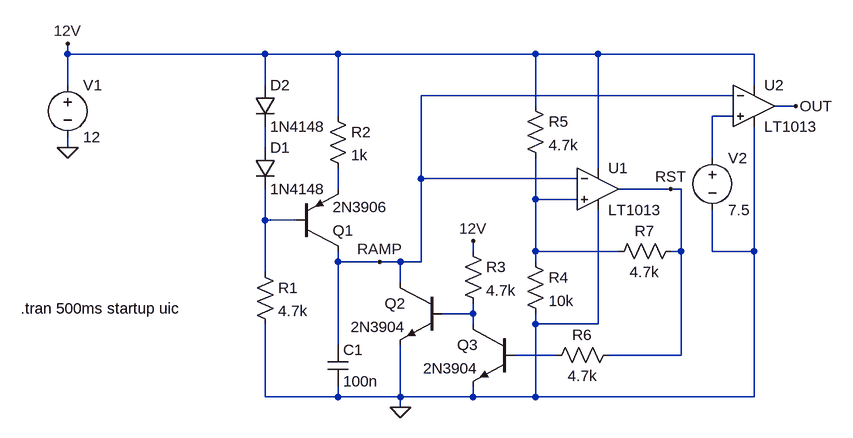
[diagram p0: schematic LAB02 Analogico-1.asc]
LAB02 Analogico-1.asc, the LTspice schematic file:
Version 4
SHEET 1 916 680
WIRE -272 -192 -272 -208
WIRE 32 -192 -272 -192
WIRE 144 -192 32 -192
WIRE 448 -192 144 -192
WIRE 544 -192 448 -192
WIRE 784 -192 544 -192
WIRE -272 -144 -272 -192
WIRE 32 -144 32 -192
WIRE 784 -144 784 -192
WIRE 752 -128 272 -128
WIRE 448 -112 448 -192
WIRE 848 -112 816 -112
WIRE 144 -96 144 -192
WIRE 752 -96 720 -96
WIRE -272 -48 -272 -64
WIRE 32 -48 32 -80
WIRE 720 -32 720 -96
WIRE 544 -16 544 -192
WIRE 272 0 272 -128
WIRE 512 0 272 0
WIRE 144 16 144 -16
WIRE 656 16 576 16
WIRE 672 16 656 16
WIRE 448 32 448 -32
WIRE 512 32 448 32
WIRE 32 64 32 16
WIRE 80 64 32 64
WIRE 352 112 352 96
WIRE 448 112 448 32
WIRE 576 112 448 112
WIRE 672 112 672 16
WIRE 672 112 656 112
WIRE 720 112 720 48
WIRE 784 112 784 -80
WIRE 784 112 720 112
WIRE 144 128 144 112
WIRE 208 128 144 128
WIRE 240 128 208 128
WIRE 272 128 272 0
WIRE 272 128 240 128
WIRE 448 128 448 112
WIRE 32 144 32 64
WIRE 240 160 240 128
WIRE 352 208 352 192
WIRE 352 208 304 208
WIRE 352 224 352 208
WIRE 448 224 448 208
WIRE 544 224 544 48
WIRE 544 224 448 224
WIRE 144 256 144 128
WIRE 480 272 416 272
WIRE 672 272 672 112
WIRE 672 272 560 272
WIRE 32 336 32 224
WIRE 144 336 144 320
WIRE 144 336 32 336
WIRE 240 336 240 256
WIRE 240 336 144 336
WIRE 352 336 352 320
WIRE 352 336 240 336
WIRE 448 336 448 224
WIRE 448 336 352 336
WIRE 784 336 784 112
WIRE 784 336 448 336
WIRE 240 352 240 336
FLAG 240 352 0
FLAG -272 -48 0
FLAG -272 -208 12V
FLAG 352 96 12V
FLAG 848 -112 OUT
FLAG 656 16 RST
FLAG 208 128 RAMP
SYMBOL res 16 128 R0
SYMATTR InstName R1
SYMATTR Value 4.7k
SYMBOL pnp 80 112 M180
SYMATTR InstName Q1
SYMATTR Value 2N3906
SYMBOL res 128 -112 R0
SYMATTR InstName R2
SYMATTR Value 1k
SYMBOL diode 16 -144 R0
SYMATTR InstName D2
SYMATTR Value 1N4148
SYMBOL voltage -272 -160 R0
WINDOW 123 0 0 Left 0
WINDOW 39 0 0 Left 0
SYMATTR InstName V1
SYMATTR Value 12
SYMBOL cap 128 256 R0
SYMATTR InstName C1
SYMATTR Value 100n
SYMBOL diode 16 -48 R0
SYMATTR InstName D1
SYMATTR Value 1N4148
SYMBOL npn 304 160 M0
SYMATTR InstName Q2
SYMATTR Value 2N3904
SYMBOL npn 416 224 M0
SYMATTR InstName Q3
SYMATTR Value 2N3904
SYMBOL res 336 96 R0
SYMATTR InstName R3
SYMATTR Value 4.7k
SYMBOL res 432 112 R0
SYMATTR InstName R4
SYMATTR Value 10k
SYMBOL res 432 -128 R0
SYMATTR InstName R5
SYMATTR Value 4.7k
SYMBOL res 576 256 R90
WINDOW 0 0 56 VBottom 2
WINDOW 3 32 56 VTop 2
SYMATTR InstName R6
SYMATTR Value 4.7k
SYMBOL res 672 96 R90
WINDOW 0 0 56 VBottom 2
WINDOW 3 32 56 VTop 2
SYMATTR InstName R7
SYMATTR Value 4.7k
SYMBOL voltage 720 -48 R0
WINDOW 123 0 0 Left 0
WINDOW 39 0 0 Left 0
SYMATTR InstName V2
SYMATTR Value 7.5
SYMBOL Opamps\\LT1013 544 -48 R0
SYMATTR InstName U1
SYMBOL Opamps\\LT1013 784 -176 R0
SYMATTR InstName U2
TEXT -344 200 Left 2 !.tran 500ms startup uic

The netlist it stands for:
* LAB02 Analogico-1.asc
R1 N005 0 4.7k
Q1 RAMP N005 N003 0 2N3906
R2 12V N003 1k
D2 12V N002 1N4148
V1 12V 0 12
C1 RAMP 0 100n
D1 N002 N005 1N4148
Q2 RAMP N006 0 0 2N3904
Q3 N006 N007 0 0 2N3904
R3 12V N006 4.7k
R4 N004 0 10k
R5 12V N004 4.7k
R6 RST N007 4.7k
R7 RST N004 4.7k
V2 N001 0 7.5
XU1 N004 RAMP 12V 0 RST LT1013  ; pins In+ In- V+ V- OUT
XU2 N001 RAMP 12V 0 OUT LT1013  ; pins In+ In- V+ V- OUT
.model D D
.lib standard.dio
.model NPN NPN
.model PNP PNP
.lib standard.bjt
.tran 500ms startup uic
.lib LTC.lib
.backanno
.end